# Altium schematic sheet SimPL_IMU_v1_0_DEC25.SchDoc
size 302 x 236 mm
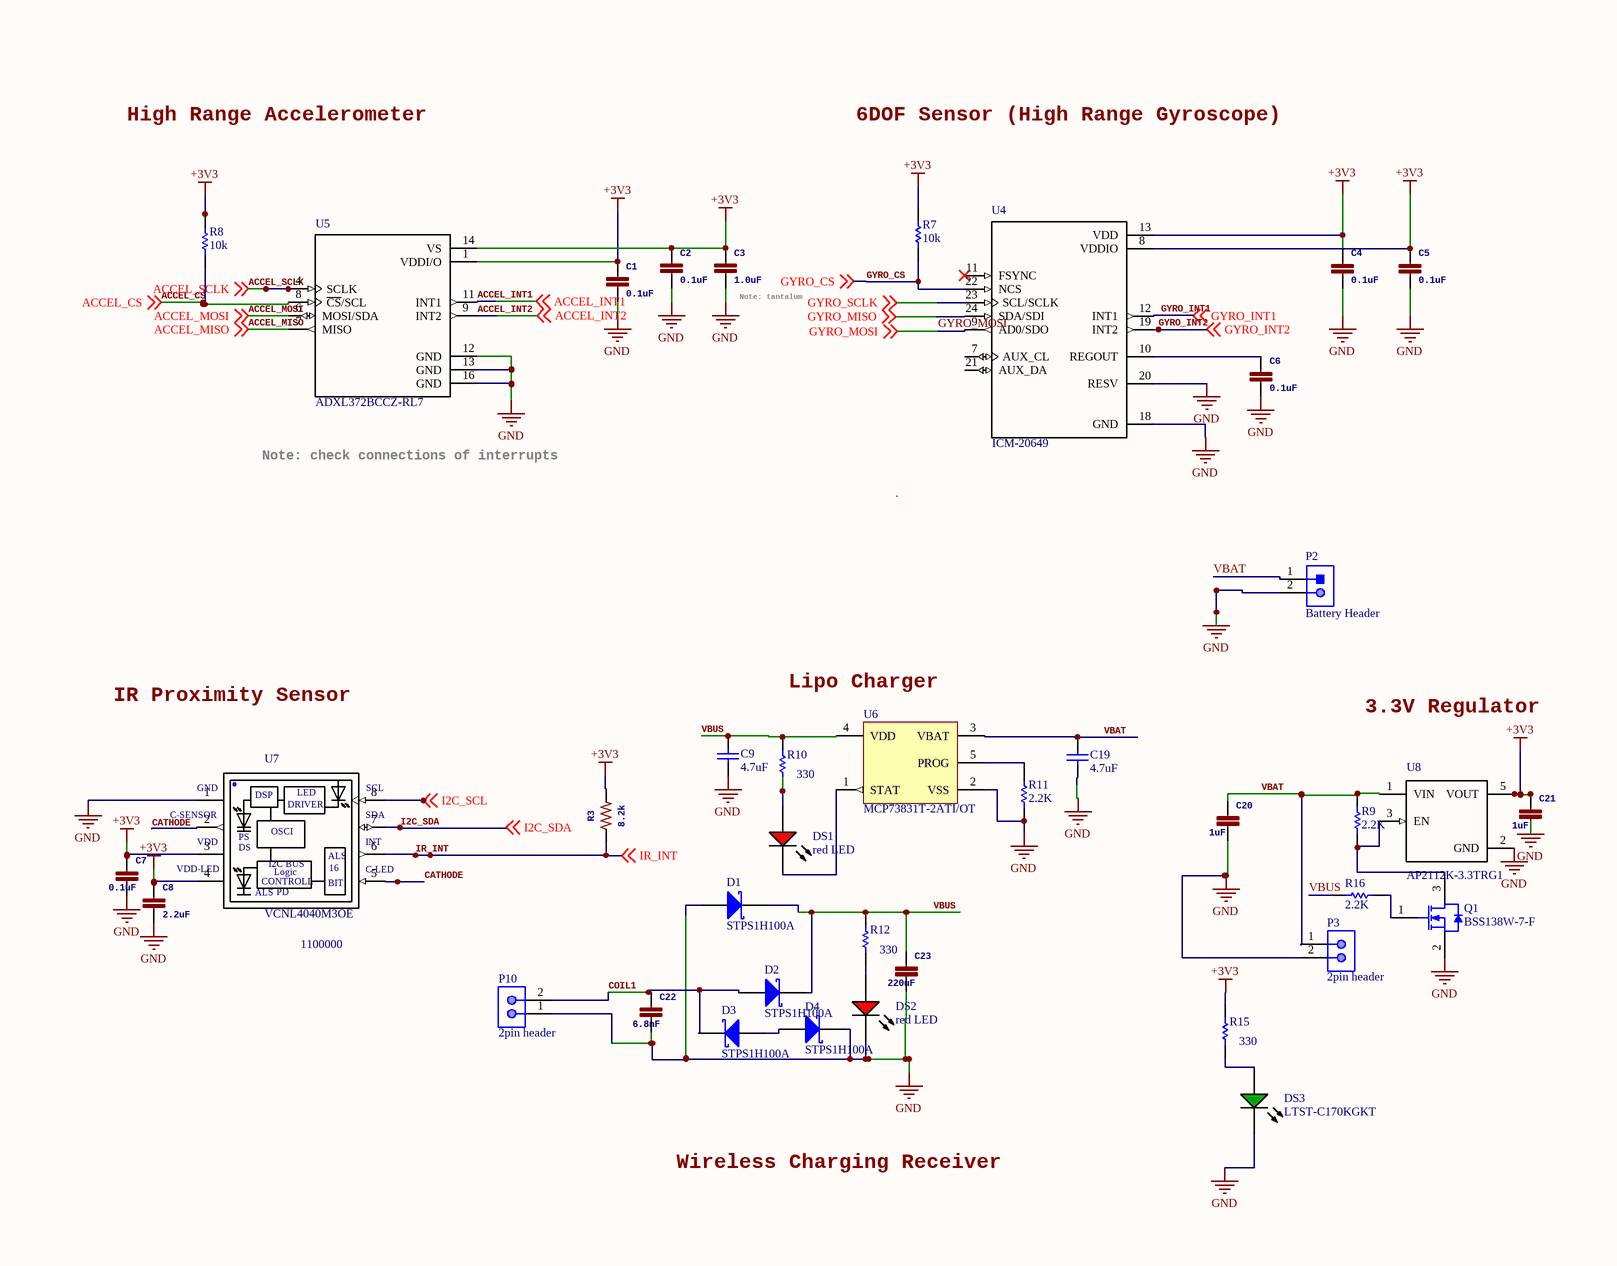
[diagram p0: SimPL_IMU_v1_0_DEC25.SchDoc]

## Parts
C1  0.1uF  [0402]
C2  0.1uF  [0402]
C3  1.0uF  [0402]
C4  0.1uF  [0402]
C5  0.1uF  [0402]
C6  0.1uF  [0402]
C7  0.1uF  [0402]
C8  2.2uF  [0402]
C9  4.7uF  [CAPC1005X65X10ML15]
C19  4.7uF  [CAPC1005X65X10ML15]
C20  1uF  [0402]
C21  1uF  [0402]
C22  6.8nF  [0402]
C23  220uF  [0402]
D1  STPS1H100A  [STM-SMA-2_V]
D2  STPS1H100A  [STM-SMA-2_V]
D3  STPS1H100A  [STM-SMA-2_V]
D4  STPS1H100A  [STM-SMA-2_V]
DS1  red LED  [VISH-TLMS1000_V]
DS2  red LED  [VISH-TLMS1000_V]
DS3  LTST-C170KGKT  [LTST-LTST-C170KGKT-2_V]
P2  Battery Header  [JST-S2B-PH-K-S_V]
P3  2pin header  [AMPH-68000-102HLF_V]
P10  2pin header  [AMPH-68000-102HLF_V]
Q1  BSS138W-7-F  [DIOD-SOT323-3_V]
R3  8.2k  [0603]
R7  10k  [RESC1005X40X25NL05T05]
R8  10k  [RESC1005X40X25NL05T05]
R9  2.2K  [RESC1005X40X25ML10T10]
R10  330  [RESC2013X50X30NL20T20]
R11  2.2K  [RESC1005X40X25ML10T10]
R12  330  [RESC2013X50X30NL20T20]
R15  330  [RESC2013X50X30NL20T20]
R16  2.2K  [RESC1005X40X25ML10T10]
U4  ICM-20649  [*QFN40P300X300X95-24N]
U5  ADXL372BCCZ-RL7  [*PQFN50P322X300X114-16N]
U6  MCP73831T-2ATI/OT  [SOT-23-OT5_M]
U7  VCNL4040M3OE  [*VISHAY_VCNL4040_4X2X1.1]
U8  AP2112K-3.3TRG1  [*SOT95P285X140-5N]

## Nets
+3V3: C1.1 C2.1 C3.1 C4.1 C5.1 C7.1 C8.1 C21.1 R3.2 R7.2 R8.2 R15.2 U4.8(VDDIO) U4.13(VDD) U5.1(VDDI/O) U5.14(VS) U7.3(VDD) U7.4(VDD-LED) U8.5(VOUT)
GND: C1.2 C2.2 C3.2 C4.2 C5.2 C6.2 C7.2 C8.2 C9.1 C19.1 C20.2 C21.2 C22.2 C23.2 D1.1(A) D4.2(K) DS2.2(K) DS3.1(K) P2.2 P3.2 P10.1 Q1.2(S) R11.1 U4.18(GND) U4.20(RESV) U5.12(GND) U5.13(GND) U5.16(GND) U6.2(VSS) U7.1(GND) U8.2(GND)
ACCEL_CS: R8.1 U5.8(~{CS}/SCL) ; off-sheet ACCEL_CS
ACCEL_INT1: U5.11(INT1) ; off-sheet ACCEL_INT1
ACCEL_INT2: U5.9(INT2) ; off-sheet ACCEL_INT2
ACCEL_MISO: U5.7(MISO) ; off-sheet ACCEL_MISO
ACCEL_MOSI: U5.6(MOSI/SDA) ; off-sheet ACCEL_MOSI
ACCEL_SCLK: U5.4(SCLK) ; off-sheet ACCEL_SCLK
CATHODE: U7.2(C-SENSOR) U7.5(C-LED)
COIL1: C22.1 D2.1(A) D3.2(K) P10.2
GYRO_CS: R7.1 U4.22(NCS) ; off-sheet GYRO_CS
GYRO_INT1: U4.12(INT1) ; off-sheet GYRO_INT1
GYRO_INT2: U4.19(INT2) ; off-sheet GYRO_INT2
GYRO_MISO: U4.24(SDA/SDI) ; off-sheet GYRO_MISO
GYRO_MOSI: U4.9(AD0/SDO) ; off-sheet GYRO_MOSI
GYRO_SCLK: U4.23(SCL/SCLK) ; off-sheet GYRO_SCLK
I2C_SCL: U7.8(SCL) ; off-sheet I2C_SCL
I2C_SDA: U7.7(SDA) ; off-sheet I2C_SDA
IR_INT: R3.1 U7.6(INT) ; off-sheet IR_INT
VBAT: C19.2 C20.1 P2.1 P3.1 R9.2 U6.3(VBAT) U8.1(VIN)
VBUS: C9.2 C23.1 D1.2(K) D2.2(K) R10.2 R12.2 R16.2 U6.4(VDD)
NetC6_1: C6.1 U4.10(REGOUT)
NetD3_1: D3.1(A) D4.1(A)
NetDS1_1: DS1.1(A) R10.1
NetDS1_2: DS1.2(K) U6.1(STAT)
NetDS2_1: DS2.1(A) R12.1
NetDS3_2: DS3.2(A) R15.1
NetQ1_1: Q1.1(G) R16.1
NetQ1_3: Q1.3(D) R9.1 U8.3(EN)
NetR11_2: R11.2 U6.5(PROG)

Not connected (* = marked no-connect by the designer): U4 7(AUX_CL) 11(FSYNC)* 21(AUX_DA)

## Notes on the sheet
- High Range Accelerometer
- 6DOF Sensor (High Range Gyroscope)
- (near C3) Note: tantalum
- Note: check connections of interrupts
- IR Proximity Sensor
- Lipo Charger
- 3.3V Regulator
- 1100000
- Wireless Charging Receiver
- Labels drawn without touching a wire or pin: I2C_SDA
- (in symbol VCNL4040M3OE) DSP; LED; DRIVER; OSCI; PS; DS; ALS; I2C BUS; Logic; 16; CONTROLL; BIT; PD

## Library data of the parts
C1 C2 C4-C7 = 0.1UF-0402-16V-10%: 0.1ÂµF ceramic capacitors    A capacitor is a passive two-terminal electrical component used to store electrical energy temporarily in an electric field.; GateName_1: G$1; SymbolName_1: CAP; PROD_ID: CAP-12416; DeviceName: -0402-16V-10%; LibraryName: SparkFun-Capacitors; DeviceSetName: 0.1UF
C3 = 1.0UF-0402-16V-10%: 1ÂµF ceramic capacitors    A capacitor is a passive two-terminal electrical component used to store electrical energy temporarily in an electric field.; GateName_1: G$1; SymbolName_1: CAP; PROD_ID: CAP-12417; DeviceName: -0402-16V-10%; LibraryName: SparkFun-Capacitors; DeviceSetName: 1.0UF
C8 C20-C23 = 0.1UF-0402-16V-10%: 0.1ÂµF ceramic capacitors    A capacitor is a passive two-terminal electrical component used to store electrical energy temporarily in an electric field.; GateName_1: G$1; SymbolName_1: CAP; DeviceSetName: 0.1UF; PROD_ID: CAP-12416; DeviceName: -0402-16V-10%; LibraryName: SparkFun-Capacitors
C9 C19 = CMP-2000-05438-1: Chip Capacitor, 4.7 uF, +/- 20%, 10 V, -55 to 85 degC, 0402 (1005 Metric), RoHS, Tape and Reel; PCN Part Number: MLCCPartNumberChange30/Nov/2012; Manufacturer: TDK; Other Names: 445-8023-1; Voltage - Rated: 10V; Temperature Coefficient: X5R; Online Catalog: CSeries,GeneralPurpose; Capacitance: 4.7µF; Kits: 445-9021-KIT-ND-KITMLCC100PF-10UF04026.3-50V445-9003-KIT-ND-KITCAPCERHICAPMLCCSMD; Product Training Modules: CSeriesGeneralApplicationsSEAT,CCV,andTVCLDesignToolsGuidetoReplacinganElectrolyticCapacitorwithanMLCC; Lead Style: -; Datasheet Version: Sep-13; Category: Capacitors; Operating Temperature: -55degC~85degC; Applications: GeneralPurpose; Standard Package: 1; RoHS Information: RoHSCertificate-MLCC; Series: C; Datasheet URL: https://datasheet.ciiva.com/24216/c1005x5r1a475m050bc-264317-24216438.pdf; Package / Case: 0402(1005Metric); Mounting Type: SurfaceMount,MLCC; Ratings: -; Tolerance: ±20%; Lead Spacing: -; Height - Seated (Max): -; Manufacturer URL: http://www.tdk.com/; Size / Dimension: 0.039"Lx0.020"W(1.00mmx0.50mm); Packaging: CutTape(CT); Family: CeramicCapacitors; Features: -; Thickness (Max): -
D1-D4 = CMP-2000-07173-1: High Voltage Power Schottky Rectifier, 1 A, 100 V, 2-Pin SMD (SMA), RoHS, Tape and Reel; Manufacturer: STMicroelectronics; Current - Reverse Leakage @ Vr: 4µA@100V; Voltage - DC Reverse (Vr) (Max): 100V; Kits: 497-8006B-KIT-ND-KITSCHOTTKYDIODE11VALUES5EA; Speed: FastRecovery=200mA(Io); Online Catalog: SchottkyDiode; Other Related Documents: STPS1H100ViewAllSpecifications; Other Names: 497-3209-1; Voltage - Forward (Vf) (Max) @ If: 770mV@1A; Current - Average Rectified (Io): 1A; Reverse Recovery Time (trr): -; Series: -; Supplier Device Package: SMA(DO-214AC); Mounting Type: SurfaceMount; Packaging: CutTape(CT); Standard Package: 1; Family: Diodes,Rectifiers-Single; Category: DiscreteSemiconductorProducts; Package Description: 2-Pin Surface Mount Device, Body 4.275 x 2.575 mm; Package URL: http://www.st.com/st-web-ui/static/active/en/resource/technical/document/datasheet/CD00283518.pdf; Operating Temperature - Junction: 175°C(Max); Datasheet Version: 09/2008; Mounting Technology: SurfaceMount; Manufacturer URL: http://www.st.com/; Package / Case: DO-214AC,SMA; Capacitance @ Vr, F: -; Diode Type: Schottky; Package Reference: SMA; Datasheet URL: http://www.st.com/content/ccc/resource/technical/document/datasheet/e8/3c/6a/07/72/b0/40/88/CD00001304.pdf/files/CD00001304.pdf/jcr:content/translations/en.CD00001304.pdf
DS1 DS2 = CMP-2000-07254-1: Low Current LED, 40 mW, 1.8 V, -40 to 100 degC, 2-Pin SMD (0603), RoHS, Tape and Reel; Manufacturer: Vishay; Lens Shape: Rectangular; Automotive Qualification Standard: AEC-Q100; Wavelength Typ: 636nm; SVHC: ToBeAdvised; Bulb Size: 1.6mmx0.8mm; Forward Voltage: 1.8V; Luminous Intensity: 4mcd; Forward Current If: 2mA; Viewing Angle: 80°; Datasheet Version: Rev. 1.7, 02/2011; Datasheet URL: https://datasheet.ciiva.com/5798/1698881-5798337.pdf; LED Mounting: SMD; Packaging: CutTape; Package Reference: TLMS1000; Manufacturer URL: http://www.vishay.com/; Mounting Technology: SurfaceMount; Product Range: -; LED Colour: Red; Package Description: 2-Pin Surface Mount Device, Body 1.6 x 0.8 mm; MSL: MSL2-1year
DS3 = CMP-2000-06620-1: Ultra Bright AlInGaP Chip LED, 75 mW, -55 to 85 degC, 2-Pin SMD (0805), RoHS, Tape and Reel; Manufacturer: Lite-On; Forward Current: 30mA; Power Dissipation Max: 75mW; Emitting Color: YellowGreen; Type: Uni-Color; Forward Voltage: 2.4V; Dominant Wave Length: 571nm; Test Current (It): 20mA; Product Length (mm): 2mm; Peak Wavelength: 574nm; Power Dissipation: 75W; Product Depth (mm): 1.25mm; DELETED: Compliant; High Brightness: Yes; Product Height (mm): 1.1mm; Luminous Intensity: 35mcd; Shape Type: Rectangular; Chip Material: AlGaInP; Viewing Angle: 130deg; Number of  Elements: 1; Reverse Voltage: 5V; Rad Hardened: No; Package Type: ChipLed; Manufacturer URL: http://www.us.liteon.com/; Mounting: SurfaceMount; Operating Temp Range: -55Cto85C; Datasheet URL: http://optoelectronics.liteon.com/upload/download/DS22-2000-073/S_110_LTST-C170KGKT.pdf; Packaging: TapeandReel; Pin Count: 2; Package Description: 2-Pin Surface Mounted Device, Body 2 x 1.25 mm; Mounting Technology: SurfaceMount; Package Reference: LTST-C170KGKT-2; Forward Current Max: 30mA; Datasheet Version: Rev. G, 06/2005; Lens Dimensions: 1.4x1.25x0.6mm; Operating Temperature Classification: Industrial; Lum Intensity: 35mcd; Main Category: ChipLED
P2 = CMP-1755-00004-1: Male Header, Pitch 2 mm, 1 x 2 Position, Height 4.8 mm, Tail Length 3.4 mm, -25 to 85 degC, RoHS, Bulk; Case\Package: Radial; Tolerance: 20%; Capacitance: 10 uF; Voltage Rating (DC): 50 V; Packaging: Bulk; ComponentLink1URL: http://www.jst-mfg.com/product/pdf/eng/ePH.pdf; Radiation Hardening: No; Height: 11 mm; Package Quantity: 200; PackageDescription: Male Header, Pitch 2 mm, 1 x 2 Position, Height 4.8 mm, Tail Length 3.4 mm; PackageReference: S2B-PH-K-S; Diameter: 5 mm; Pins: 2; Mount: Through Hole; Max Operating Temperature: 85 degC; Min Operating Temperature: -40 degC; ComponentLink1Description: Datasheet; DatasheetVersion: Dec-12; Length: 11 mm; Lead Pitch: 2 mm; REACH SVHC: No SVHC; Voltage Rating: 50 V; RoHSCompliant: true
P3 P10 = CMP-2000-05666-1: Male Header, Pitch 2.54 mm, 1 x 2 Position, Height 8.38 mm, Tail Length 2.41 mm, RoHS, Bulk; Number of Positions: 2; Insulation Resistance: 5000MOhms; Voltage Rating: 1.5kV; Mounting Angle: Vertical; Pitch: 2.54mm; Brand: FCI; Current Rating: 3A; Mating Post Length: 5.84mm; Operating Temperature Range: -65Cto+125C; Product Category: Headers&WireHousings; Datasheet URL: https://datasheet.ciiva.com/5149/68000-274228-5149165.pdf; Number of Positions / Contacts: 2; Contact Gender: Pin(Male); Packaging: Bulk; Mounting Technology: ThroughHole; Product Type: Headers; Housing Material: Thermoplastic; Contact Material: PhosphorBronze; Contact Plating: Gold/GTX; Package Description: Male Header, Pitch 2.54 mm, 1 x 2 Position, Height 8.38 mm, Tail Length 2.41 mm; Package Reference: 68000-102HLF; Type: Unshrouded; Factory Pack Quantity: 100; Termination Style: ThroughHole; RoHS: Details; Series: 68000; Mounting Style: ThroughHole; Flammability Rating: UL94V-0; Number of Rows: 1; Manufacturer: FCI; Termination Post Length: 2.41mm; Manufacturer URL: http://www.amphenol.com/; Datasheet Version: Rev. F, 04/2006
Q1 = CMP-2000-05968-1: N-Channel Enhancement Mode Mosfet, 50 V, 200 mA, -55 to 150 degC, 6-Pin SOT-323, RoHS, Tape and Reel; Typical Turn-Off Delay Time: 20ns; Number of Channels: 1Channel; Type: EnhancementModeFieldEffectTransistor; Brand: DiodesIncorporated; Vds - Drain-Source Breakdown Voltage: 75V; Vgs - Gate-Source Voltage: 20V; Rds On - Drain-Source Resistance: 1.4Ohms; Transistor Type: 1N-Channel; Configuration: Single; Unit Weight: 0.000212oz; Pd - Power Dissipation: 200mW; Id - Continuous Drain Current: 200mA; Forward Transconductance - Min: 0.1S; Manufacturer URL: http://www.diodes.com/; Series: BSS138; Package Description: 3-Pin Small Outline Transistor, Body 2 x 1.25 mm, Pitch 0.65 mm; Mounting Technology: SurfaceMount; Product Category: MOSFET; RoHS: True; Maximum Operating Temperature: +150C; Height: 1mm; Length: 2.2mm; Technology: Si; Width: 1.35mm; Datasheet URL: http://www.diodes.com/_files/datasheets/ds30206.pdf; Manufacturer: DiodesIncorporated; Package / Case: SOT-323-3; Typical Turn-On Delay Time: 20ns; Transistor Polarity: N-Channel; Factory Pack Quantity: 3000; Packaging: Reel; Product: MOSFETSmallSignal; Datasheet Version: Rev. 11-2, 09/2013; Package Reference: SOT323; Minimum Operating Temperature: -55C; Mounting Style: SMD/SMT; Channel Mode: Enhancement
R3 = 8.2KOHM-0603-1/10W-5%: 8.2kÎ© resistor    A resistor is a passive two-terminal electrical component that implements electrical resistance as a circuit element. Resistors act to reduce current flow, and, at the same time, act to lower voltage levels within circuits. - Wikipedia; GateName_1: G$1; PROD_ID: RES-10646; SymbolName_1: RESISTOR; DeviceName: -0603-1/10W-5%; LibraryName: SparkFun-Resistors; DeviceSetName: 8.2KOHM
R7 R8 = CMP-2002-00607-3: Chip Resistor, 10 KOhm, +/- 1%, 100 mW, -55 to 155 degC, 0402 (1005 Metric), RoHS, Tape and Reel; Manufacturer: Basic Passives; PartNumber: ERJ-2RKF1002X; Case\/Package: 0402; Resistance: 10 KOhm; Voltage Rating: 50 V; Power Rating: 100 mW; Packaging: Tape and Reel; Width: 0.5 mm; Package Quantity: 10000; Radiation Hardening: No; Min Operating Temperature: -55 degC; Case Code (Imperial): 0402; REACH SVHC: Yes; PackageDescription: 2-Pin Surface Mount Device, Body 1 x 0.5 mm; Length: 1 mm; ComponentLink1Description: Manufacturer URL; PackageReference: 0402; RoHSCompliant: true; ComponentLink1URL: http://www.panasonic.com/; Height: 0.35 mm; ComponentLink2Description: Datasheet; DatasheetVersion: 04/2015; Mounting Technology: Surface Mount; ComponentLink2URL: http://industrial.panasonic.com/cdbs/www-data/pdf/RDA0000/AOA0000C86.pdf; Max Operating Temperature: 155 degC; Pins: 2; Tolerance: 1%; Case Code (Metric): 1005; Mount: Surface Mount
R9 R11 R16 = CMP-2002-06097-1: Part Number: MC00625W040212K2; Manufacturer: Multicomp
R10 R12 R15 = CMP-2001-03823-1: Manufacturer: Vishay Dale; Part Number: CRCW0805330RFKEA
U4 = ICM-20649: Wide-Range 6-Axis MEMS MotionTracking Device for Sports and High Impact Applications; MF: TDK InvenSense; MP: ICM-20649; Price: None; SnapEDA_Link: https://www.snapeda.com/parts/ICM-20649/TDK%20InvenSense/view-part/?ref=snap; Package: QFN-24 InvenSense; Availability: Unavailable; Value: *
U5 = ADXL372BCCZ-RL7: / Accelerometer Triple Â±200g 2.5V 16-Pin LGA T/R /; MF: Analog Devices; SnapEDA_Link: https://www.snapeda.com/parts/ADXL372BCCZ-RL7/Analog%20Devices%20Inc./view-part/?ref=snap; Availability: Unavailable; Price: None; MP: ADXL372BCCZ-RL7; Package: LGA-16 Analog Devices; Value: *
U6 = CMP-0133-00144-1: Miniature Single-Cell, Fully Integrated Li-Ion, Li-Polymer Charge Management Controller, 4.2V, 5-Pin SOT-23, Industrial Temperature, Tape and Reel; DatasheetVersion: revE, Sep-2008; PackageVersion: revBB, Aug-2009; PackageReference: SOT-23-OT5; PackageDescription: 5-Lead Plastic Small Outline Transistor (OT) [SOT-23]; Code_IPC: SOT23-5
U7 = VCNL4040M3OE: VCNL4040 Series 3.6 V 200 mm 16 Bit I2C SMT Proximity and Ambient Light Sensor; MF: Vishay; SnapEDA_Link: https://www.snapeda.com/parts/VCNL4040M3OE/Vishay%20Semiconductor%20Opto%20Division/view-part/?ref=snap; Availability: Unavailable; Price: None; MP: VCNL4040M3OE; Package: SMD-8 Vishay; Value: *
U8 = AP2112K-3.3TRG1: AP2112 Series 0.6 A 3.3 V Fixed Output SMT LDO Linear Regulator - SOT23-5; MF: Diodes Inc.; Availability: Unavailable; Package: SOT-753 Diodes Inc.; Price: None; SnapEDA_Link: https://www.snapeda.com/parts/AP2112K-3.3TRG1/Diodes%20Inc./view-part/?ref=snap; MP: AP2112K-3.3TRG1; Value: *